# Altium schematic sheet Input.SchDoc: Input: canal antirrebote 74HC14 a 3.3 V (se instancia x4)
size A4; Author: Efrain Alvarado; CompanyName: Universidad de Cuenca - MCIE; DrawnBy: Efrain Alvarado; DocumentNumber: E08-I; Revision: 1.0; SheetNumber: 1; SheetTotal: 1
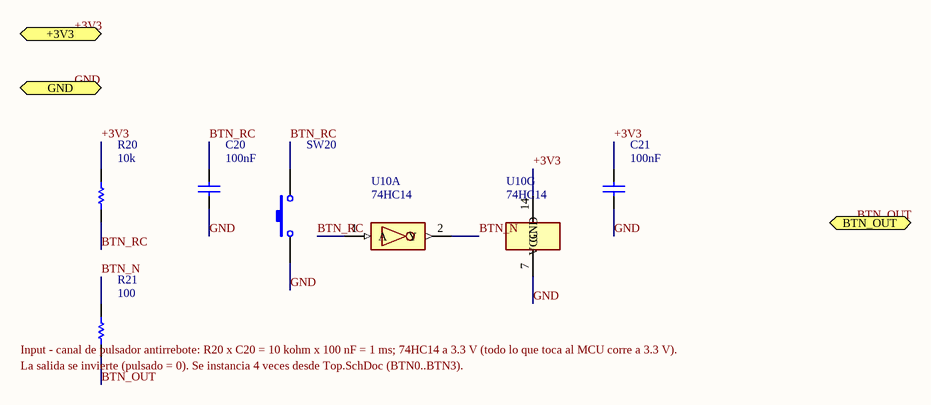
[diagram p0: Input.SchDoc]

## Parts
C20  value 100nF  [0603]  (hidden comment: Cap)
C21  value 100nF  [0603]  (hidden comment: Cap)
R20  value 10k  [0603]  (hidden comment: Res1)
R21  value 100  [0603]  (hidden comment: Res1)
SW20  SW-PB  [SPST-2]  (value not drawn)
U10  74HC14  [DIP-14]  (parts A,G of 7)

## Ports
+3V3, BTN_OUT, GND

## Nets
+3V3: C21.2 R20.2 U10.14(VCC) ; port +3V3
BTN_N: R21.2 U10.2(Y)
BTN_OUT: R21.1 ; port BTN_OUT
BTN_RC: C20.2 R20.1 SW20.2 U10.1(A)
GND: C20.1 C21.1 SW20.1 U10.7(GND) ; port GND

## Notes on the sheet
- (near R21) Input - canal de pulsador antirrebote: R20 x C20 = 10 kohm x 100 nF = 1 ms; 74HC14 a 3.3 V (todo lo que toca al MCU corre a 3.3 V).
- (near R21) La salida se invierte (pulsado = 0). Se instancia 4 veces desde Top.SchDoc (BTN0..BTN3).

## Library data of the parts
C20 C21 = Cap: Capacitor 100nF; Manufacturer: KEMET; Manufacturer Part Number: C0603C100nF; Published: 8-Jun-2000; LatestRevisionDate: 17-Jul-2002; LatestRevisionNote: Re-released for DXP Platform.; PackageReference: RAD-0.3; Publisher: Altium Limited; PackageDescription: Radial Cap, Thru-Hole; 2 Leads; 0.3 in Pin Spacing
R20 = Res1: Resistor 10k 0603; Manufacturer: Yageo; Manufacturer Part Number: RC0603FR-0710K; Published: 8-Jun-2000; LatestRevisionDate: 17-Jul-2002; LatestRevisionNote: Re-released for DXP Platform.; PackageReference: AXIAL-0.3; Publisher: Altium Limited; PackageDescription: Axial Device, Thru-Hole; 2 Leads; 0.3 in Pin Spacing
R21 = Res1: Resistor 100 0603; Manufacturer: Yageo; Manufacturer Part Number: RC0603FR-07100; Published: 8-Jun-2000; LatestRevisionDate: 17-Jul-2002; LatestRevisionNote: Re-released for DXP Platform.; PackageReference: AXIAL-0.3; Publisher: Altium Limited; PackageDescription: Axial Device, Thru-Hole; 2 Leads; 0.3 in Pin Spacing
SW20 = SW-PB: Pulsador NA; Manufacturer: Generic; Manufacturer Part Number: Tactile 6x6; Published: 24-Mar-1999; LatestRevisionDate: 17-Jul-2002; LatestRevisionNote: Re-released for DXP Platform.; PackageReference: SPST-2; Publisher: Altium Limited; PackageDescription: Switch; 2 Leads
U10 = 74HC14: Hex Schmitt-trigger inverter 6 gates (A-F) + power part G (VCC=14, GND=7); Manufacturer: Texas Instruments; Manufacturer Part Number: SN74HC14N